# EAGLE design BIOS-hack (EAGLE 5.10)
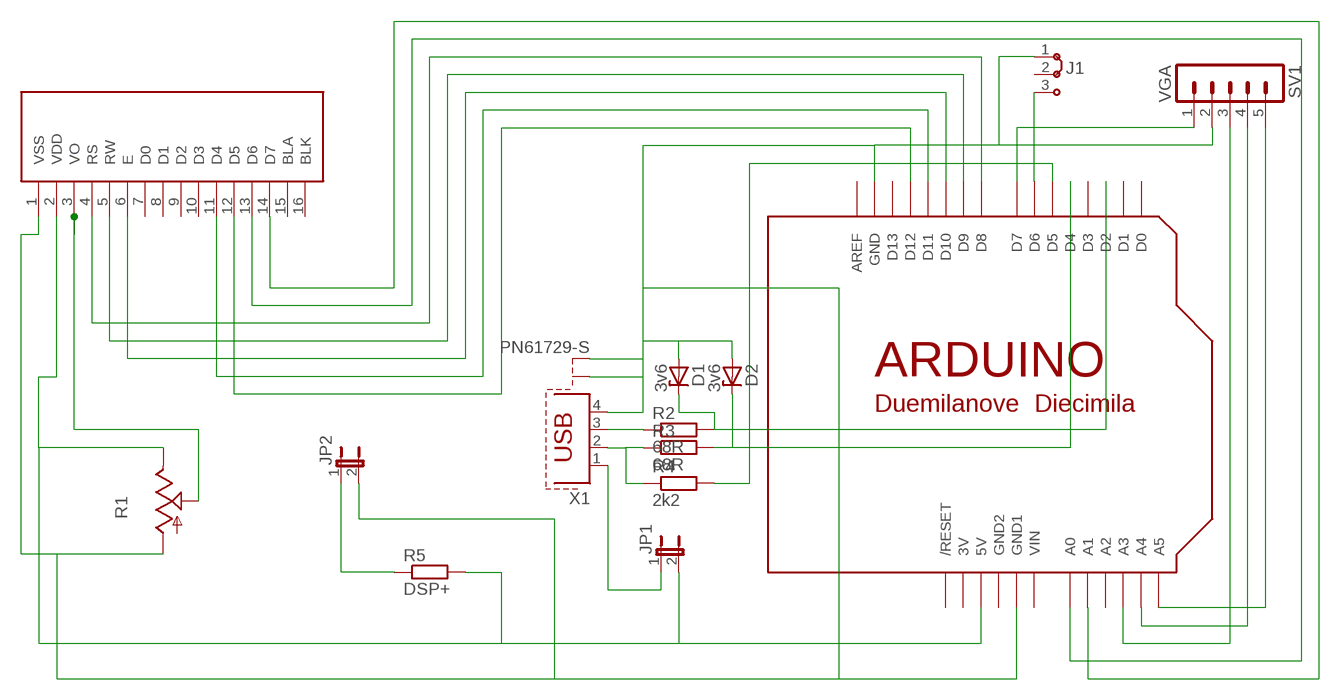
[diagram p0: schematic, sheet 1]

## Parts
D1  3v6  ZENER-DIODEDO34-7  [DO34Z7]
D2  3v6  ZENER-DIODEDO34-7  [DO34Z7]
J1  J2X2MM  [04C]
JP1  JP1E  [JP1]
JP2  JP1E  [JP1]
R1  TRIM_US-RJ6S  [RJ6S]
R2  68R  R-EU_0204/7  [0204/7]
R3  68R  R-EU_0204/7  [0204/7]
R4  2k2  R-EU_0204/7  [0204/7]
R5  DSP+  R-EU_0204/7  [0204/7]
SV1  VGA  MA05-1  [MA05-1]
U$1  ARDUINO-NOHOLE  [ARDUINO-NOHOLE]
U$2  2X16LCDTOP  [2X16LCDTOP]
X1  PN61729-S  [PN61729-S]

## Nets
N$1: JP1.2 R1.E R5.2 U$1.5V U$2.2(VDD)
N$2: J1.3 U$1.D6
N$3: D1.A D2.A J1.1 JP2.2 R1.A SV1.2 U$1.GND U$1.GND1 U$2.1(VSS) X1.4 X1.S1 X1.S2
N$4: U$1.D11 U$2.11(D4)
N$5: U$1.D10 U$2.6(E)
N$6: U$1.D9 U$2.5(RW)
N$7: U$1.D8 U$2.4(RS)
N$8: U$1.A1 U$2.14(D7)
N$9: JP2.1 R5.1
N$10: R1.S U$2.3(VO)
N$11: U$1.D12 U$2.12(D5)
N$12: JP1.1 X1.1
N$13: R4.2 U$1.D5
N$14: R3.1 R4.1 X1.2
N$15: D2.C R3.2 U$1.D4
N$16: D1.C R2.2 U$1.D2
N$17: R2.1 X1.3
N$19: U$1.A0 U$2.13(D6)
N$20: SV1.1 U$1.D7
N$21: SV1.5 U$1.A5
N$22: SV1.4 U$1.A4
N$23: SV1.3 U$1.A3
Unconnected: J1.2 U$1.A2 U$1.AREF U$1.D0 U$1.D1 U$1.D3 U$1.D13 U$1.RESET(/RESET) U$2.7(D0) U$2.8(D1) U$2.9(D2) U$2.10(D3) U$2.15(BLA) U$2.16(BLK)

## Power pins joined to a net without a drawn wire
3V: U$1.3V
GND2: U$1.GND2
VIN: U$1.VIN

## Library data of the parts
D1 D2 = diode:ZENER-DIODE: Z-Diode
J1 = jumper:J2: Jumper switch 2 x 2.5 mm
JP1 JP2 = jumper:JP1E: JUMPER
R1 = pot:TRIM_US-: POTENTIOMETER
R2-R5 = rcl:R-EU_: RESISTOR, European symbol
SV1 = con-lstb:MA05-1: PIN HEADER
U$1 = adafruit:ARDUINO: Arduino Diecimila/Duemilanove Make a shield with ease, this package has all the named pins as well as the two mounting drill holes and an outline of the USB and DC power connector. The outline is on the DIMENSION layer, so if your board house uses it they will cut the outline to match. http://www.ladyada.net/library/pcb/eaglelibrary.html
U$2 = lcd_modules_ece:2X16LCDTOP
X1 = con-berg:PN61729-S: BERG USB connector

## Board
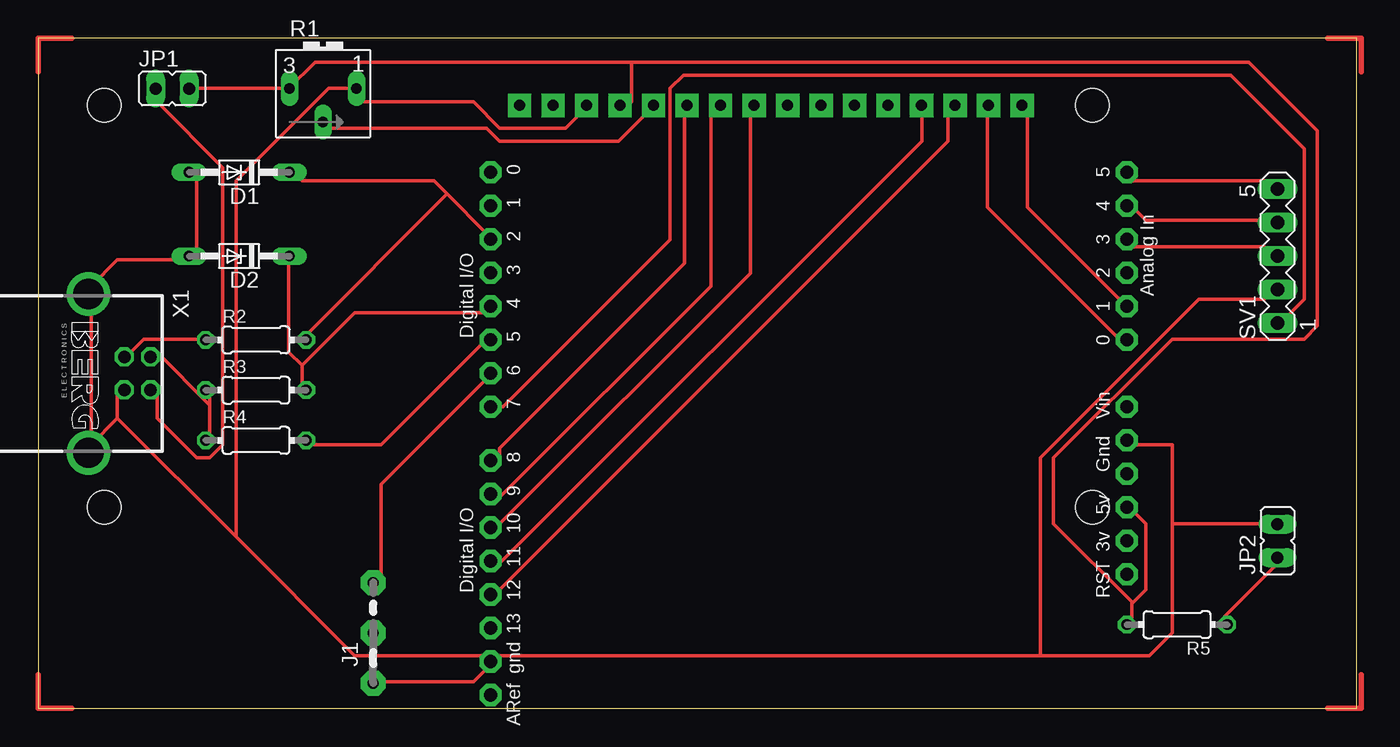
[diagram p1: board, top side]
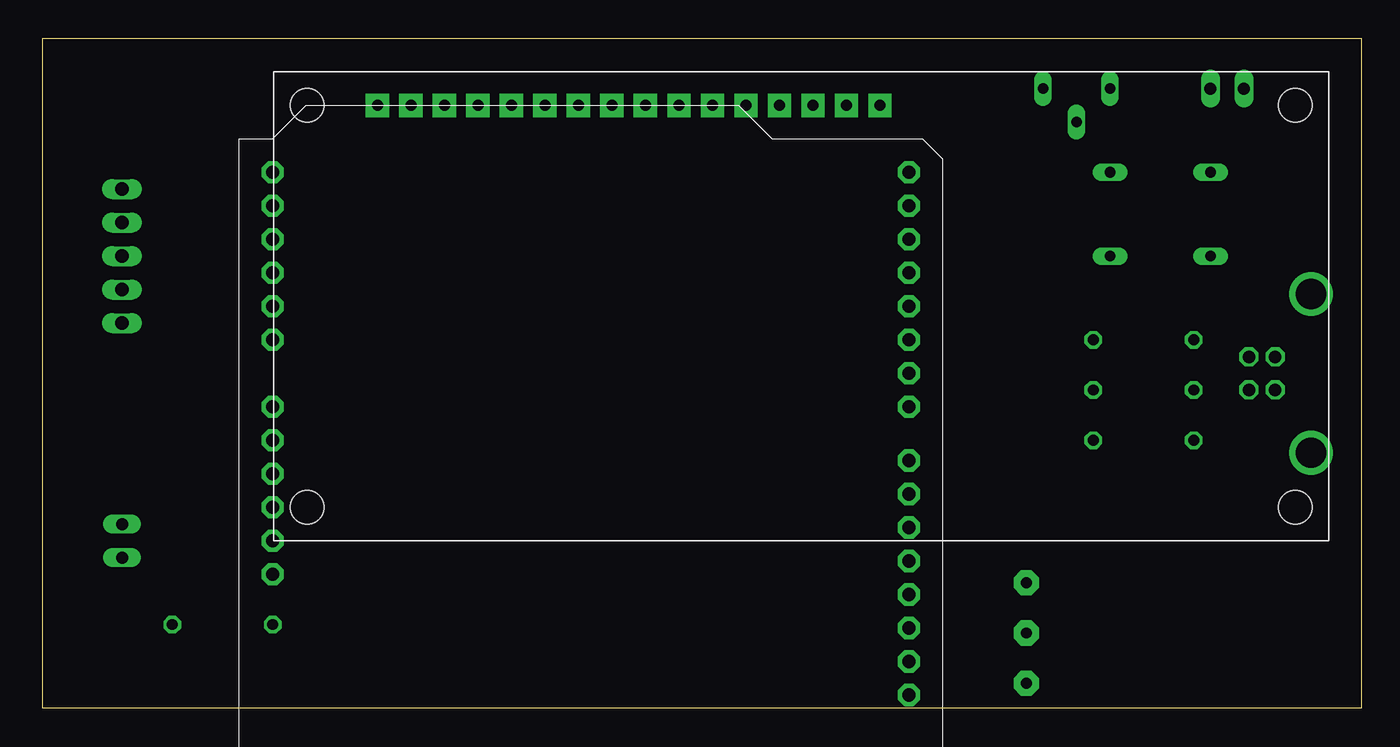
[diagram p2: board, bottom side, seen from below]

Size 100 x 50.79 mm. Coordinates in mm from the lower left corner, seen from the top.
Outline: 0,0 100,0 100,50.79 0,50.79 0,0
Copper layers 1: Top 0.035mm
Design rules "default *": minimum track width 10mil, minimum drill 24mil, track to track 8mil, track to pad 8mil, pad to pad 8mil, via to via 8mil, smd to smd 8mil, copper to edge 40mil, drill to drill 8mil, minimum pad ring 10mil, minimum via ring 8mil, stop-mask expansion 4mil, vias tented up to drill 0mil, thermal gap 10mil

### Footprints (pad centres in the part's own frame; a part is rotated, then mirrored left to right if it is on the bottom)
DO34Z7 = drill 0.813 long: A 3.81,0; C -3.81,0
04C = drill 0.813 pad 1.905 octagon: 1 -1.905,0; 2 1.905,0; 3 5.715,0
JP1 = drill 0.914 long: 1 0,-1.27; 2 0,1.27
RJ6S = drill 0.813 long: A 2.54,0; E -2.54,0; S 0,-2.54
0204/7 = drill 0.813 octagon: 1 -3.81,0; 2 3.81,0
MA05-1 = drill 1.016 long: 1 -5.08,0; 2 -2.54,0; 3 0,0; 4 2.54,0; 5 5.08,0
ARDUINO-NOHOLE = drill 1 pad 1.676 octagon: 3V 35.56,2.54; 5V 38.1,2.54; A0 50.8,2.54; A1 53.34,2.54; A2 55.88,2.54; A3 58.42,2.54; A4 60.96,2.54; A5 63.5,2.54; AREF 23.876,50.8; D0 63.5,50.8; D1 60.96,50.8; D2 58.42,50.8; D3 55.88,50.8; D4 53.34,50.8; D5 50.8,50.8; D6 48.26,50.8; D7 45.72,50.8; D8 41.656,50.8; D9 39.116,50.8; D10 36.576,50.8; D11 34.036,50.8; D12 31.496,50.8; D13 28.956,50.8; GND 26.416,50.8; GND1 43.18,2.54; GND2 40.64,2.54; RESET 33.02,2.54; VIN 45.72,2.54
2X16LCDTOP = drill 0.85 pad 1.778 square: 1 40.89,33.02; 2 38.35,33.02; 3 35.81,33.02; 4 33.27,33.02; 5 30.73,33.02; 6 28.19,33.02; 7 25.65,33.02; 8 23.11,33.02; 9 20.57,33.02; 10 18.03,33.02; 11 15.49,33.02; 12 12.95,33.02; 13 10.41,33.02; 14 7.87,33.02; 15 43.43,33.02; 16 45.97,33.02 | hole 2.54: 2.54,33.02; 77.47,33.02; 77.47,2.54; 2.54,2.54
PN61729-S = drill 0.95 octagon: 1 1.25,4.71; 2 -1.25,4.71; 3 -1.25,2.71; 4 1.25,2.71 | drill 2.3 pad 2.9 round: S1 -6.02,0; S2 6.02,0

### Placement (x,y rotation side)
D1  15.24,40.64 180 top
D2  15.24,34.29 180 top
J1  25.4,3.81 90 top
JP1  10.16,46.99 270 top
JP2  93.98,12.7 0 top
R1  21.59,46.99 0 top
R2  16.51,27.94 0 top
R3  16.51,24.13 0 top
R4  16.51,20.32 0 top
R5  86.36,6.35 180 top
SV1  93.98,34.29 90 top
U$1  85.09,-22.86 90 top
U$2  82.47,12.7 0 bottom
X1  3.81,25.4 270 top

### Tracks (layer width: path | path; a pad name or v marks a point on that pad's centre or on a via)
N$1
  Top 0.254: 83,8 84,9 84,14 83,15 U$1.5V | 19,47 12,47 JP1.2 | 19,47 21,49 45,49 | 19,47 R1.E | 83,8 77,14 77,19 86,28 96,28 97,29 97,43.81 91.81,49 45,49 | 83,8 82.93,8 82.93,6.73 R5.2 | 45,49 45,46 U$2.2
N$2
  Top 0.254: U$1.D6 34,25 26,17 26,10 J1.3
N$3
  Top 0.254: D1.A 12,40 12,34 D2.A 11,34 6,34 4,32 X1.S1 4,31 4,20 | U$1.GND1 83,20 86,20 86,14 | 6,22 6,24 X1.4 | 4,20 6,22 | 6,22 15,13 | 86,14 86,5.73 84.27,4 76,4 | 76,4 35,4 U$1.GND | 15,13 15,40 22,47 24,47 R1.A 24,46 33,46 35,44 40,44 41,45 U$2.1 | X1.S2 4,20 | J1.1 26,2 33,2 34,3 U$1.GND | 15,13 24,4 34,4 U$1.GND | 86,14 93,14 JP2.2 | 76,4 76,19 88,31 93,31 SV1.2
N$4
  Top 0.254: U$1.D11 35,11 67,43 67,45 U$2.11
N$5
  Top 0.254: U$1.D10 35,14 54,33 54,45 U$2.6
N$6
  Top 0.254: U$1.D9 35,16 51,32 51,45 U$2.5
N$7
  Top 0.254: U$1.D8 35,19 35,19.73 49,33.73 49,45 U$2.4
N$8
  Top 0.254: U$1.A1 82,31 75,38 75,45 U$2.14
N$9
  Top 0.254: R5.1 90,7 94,11 JP2.1
N$10
  Top 0.254: R1.S 22,44 34,44 35,43 44,43 46,45 U$2.3
N$11
  Top 0.254: U$1.D12 35,9 69,43 69,45 U$2.12
N$12
  Top 0.254: JP1.1 9,46 14,41 14,20 13,19 12,19 9,22 9,24 X1.1
N$13
  Top 0.254: R4.2 20,20 26,20 34,28 U$1.D5
N$14
  Top 0.254: 13,23 13,24 R3.1 | 13,23 13,20 R4.1 | 13,23 9,27 X1.2
N$15
  Top 0.254: 20,26 20,24 R3.2 | 20,26 19,27 19,34 D2.C | 20,26 24,30 34,30 U$1.D4
N$16
  Top 0.254: 31,39 34,36 U$1.D2 | 31,39 30,40 20,40 D1.C | 31,39 20,28 R2.2
N$17
  Top 0.254: R2.1 13,28 8,28 7,27 X1.3
N$18
  Top 0.406: 0,48.26 0,50.8 2.54,50.8
N$19
  Top 0.254: U$1.A0 82,28 72,38 72,45 U$2.13
N$20
  Top 0.254: SV1.1 94,29 96,31 96,42.43 90.43,48 48.92,48 47.92,47 47.92,35.54 35.24,22.86 U$1.D7 34,23
N$21
  Top 0.254: SV1.5 93,40 83,40 U$1.A5
N$22
  Top 0.254: SV1.4 93,37 84,37 83,38 U$1.A4
N$23
  Top 0.254: SV1.3 93,35 83,35 U$1.A3
N$24
  Top 0.406: 0,2.54 0,0 2.54,0
N$25
  Top 0.406: 97.79,50.8 100.33,50.8 100.33,48.26
N$26
  Top 0.406: 97.79,0 100.33,0 100.33,2.54